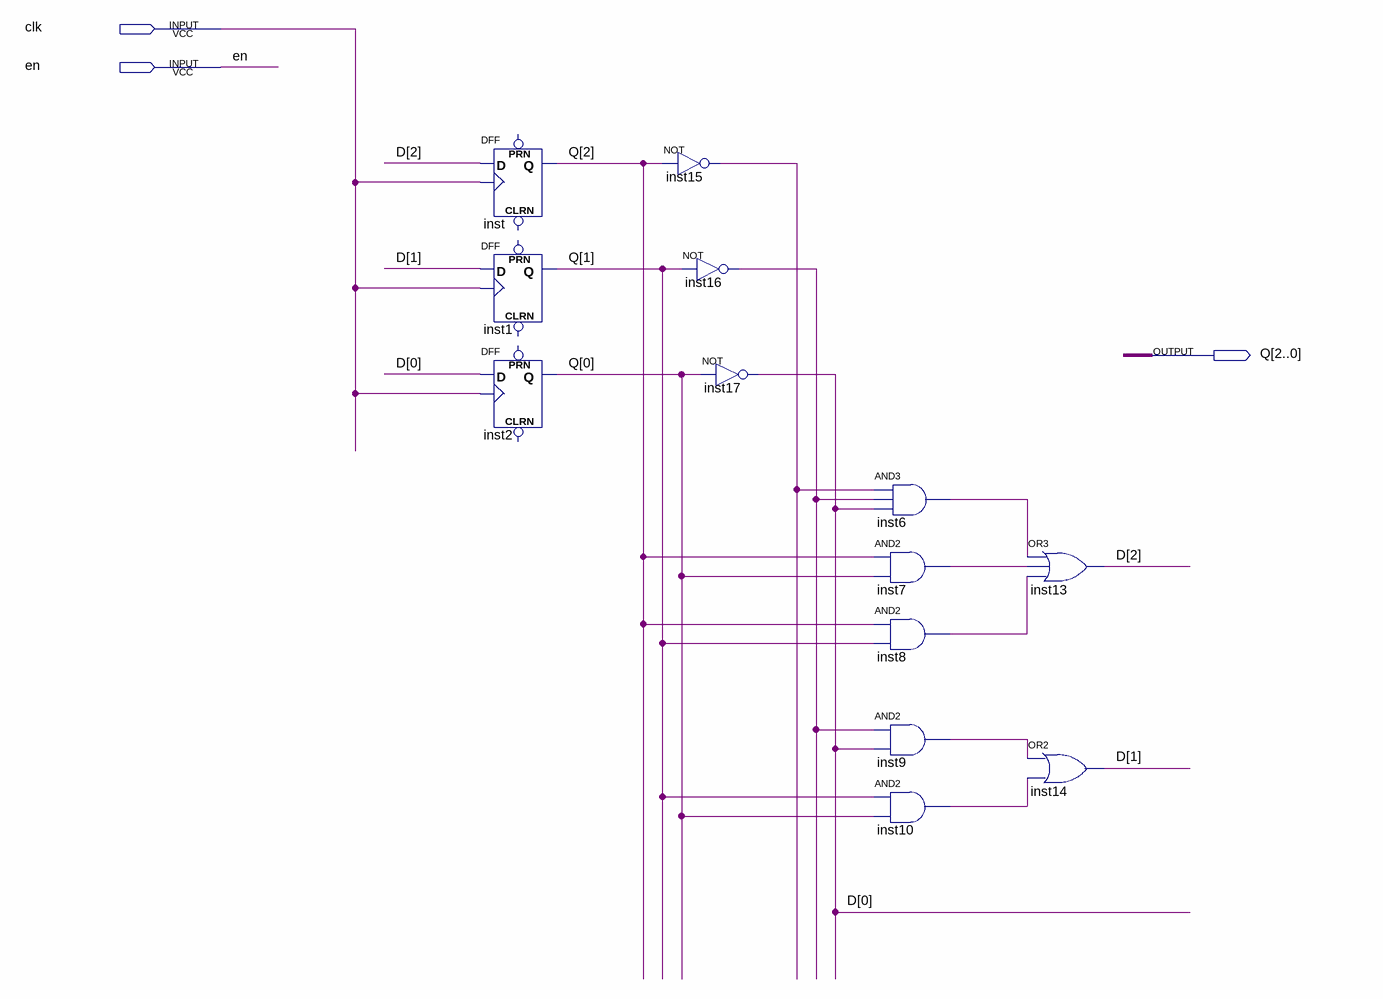
[diagram p0: schematic sheet]
// Quartus schematic downcounter.bdf as structural Verilog: 13 symbols, 3 pins
module downcounter (
  input  clk,
  input  en,
  output [2:0] Q
);

  wire inst6_out, inst7_out, inst8_out, inst9_out, inst10_out, inst15_out, inst16_out;
  wire [2:0] D;

  DFF inst (.CLK(clk), .D(D[2]), .Q(Q[2]));  // open: CLRN, PRN
  DFF inst1 (.CLK(clk), .D(D[1]), .Q(Q[1]));  // open: CLRN, PRN
  DFF inst2 (.CLK(clk), .D(D[0]), .Q(Q[0]));  // open: CLRN, PRN
  not inst15 (inst15_out, Q[2]);
  not inst16 (inst16_out, Q[1]);
  not inst17 (D[0], Q[0]);
  and inst6 (inst6_out, inst15_out, inst16_out, D[0]);
  and inst7 (inst7_out, Q[2], Q[0]);
  and inst8 (inst8_out, Q[2], Q[1]);
  and inst9 (inst9_out, inst16_out, D[0]);
  and inst10 (inst10_out, Q[1], Q[0]);
  or inst13 (D[2], inst6_out, inst7_out, inst8_out);
  or inst14 (D[1], inst9_out, inst10_out);
endmodule
